# EAGLE design J6_output (EAGLE 7.5.0)
Redwave S310-J6 Output to 10 Pin MiniFit Valve Driver Board
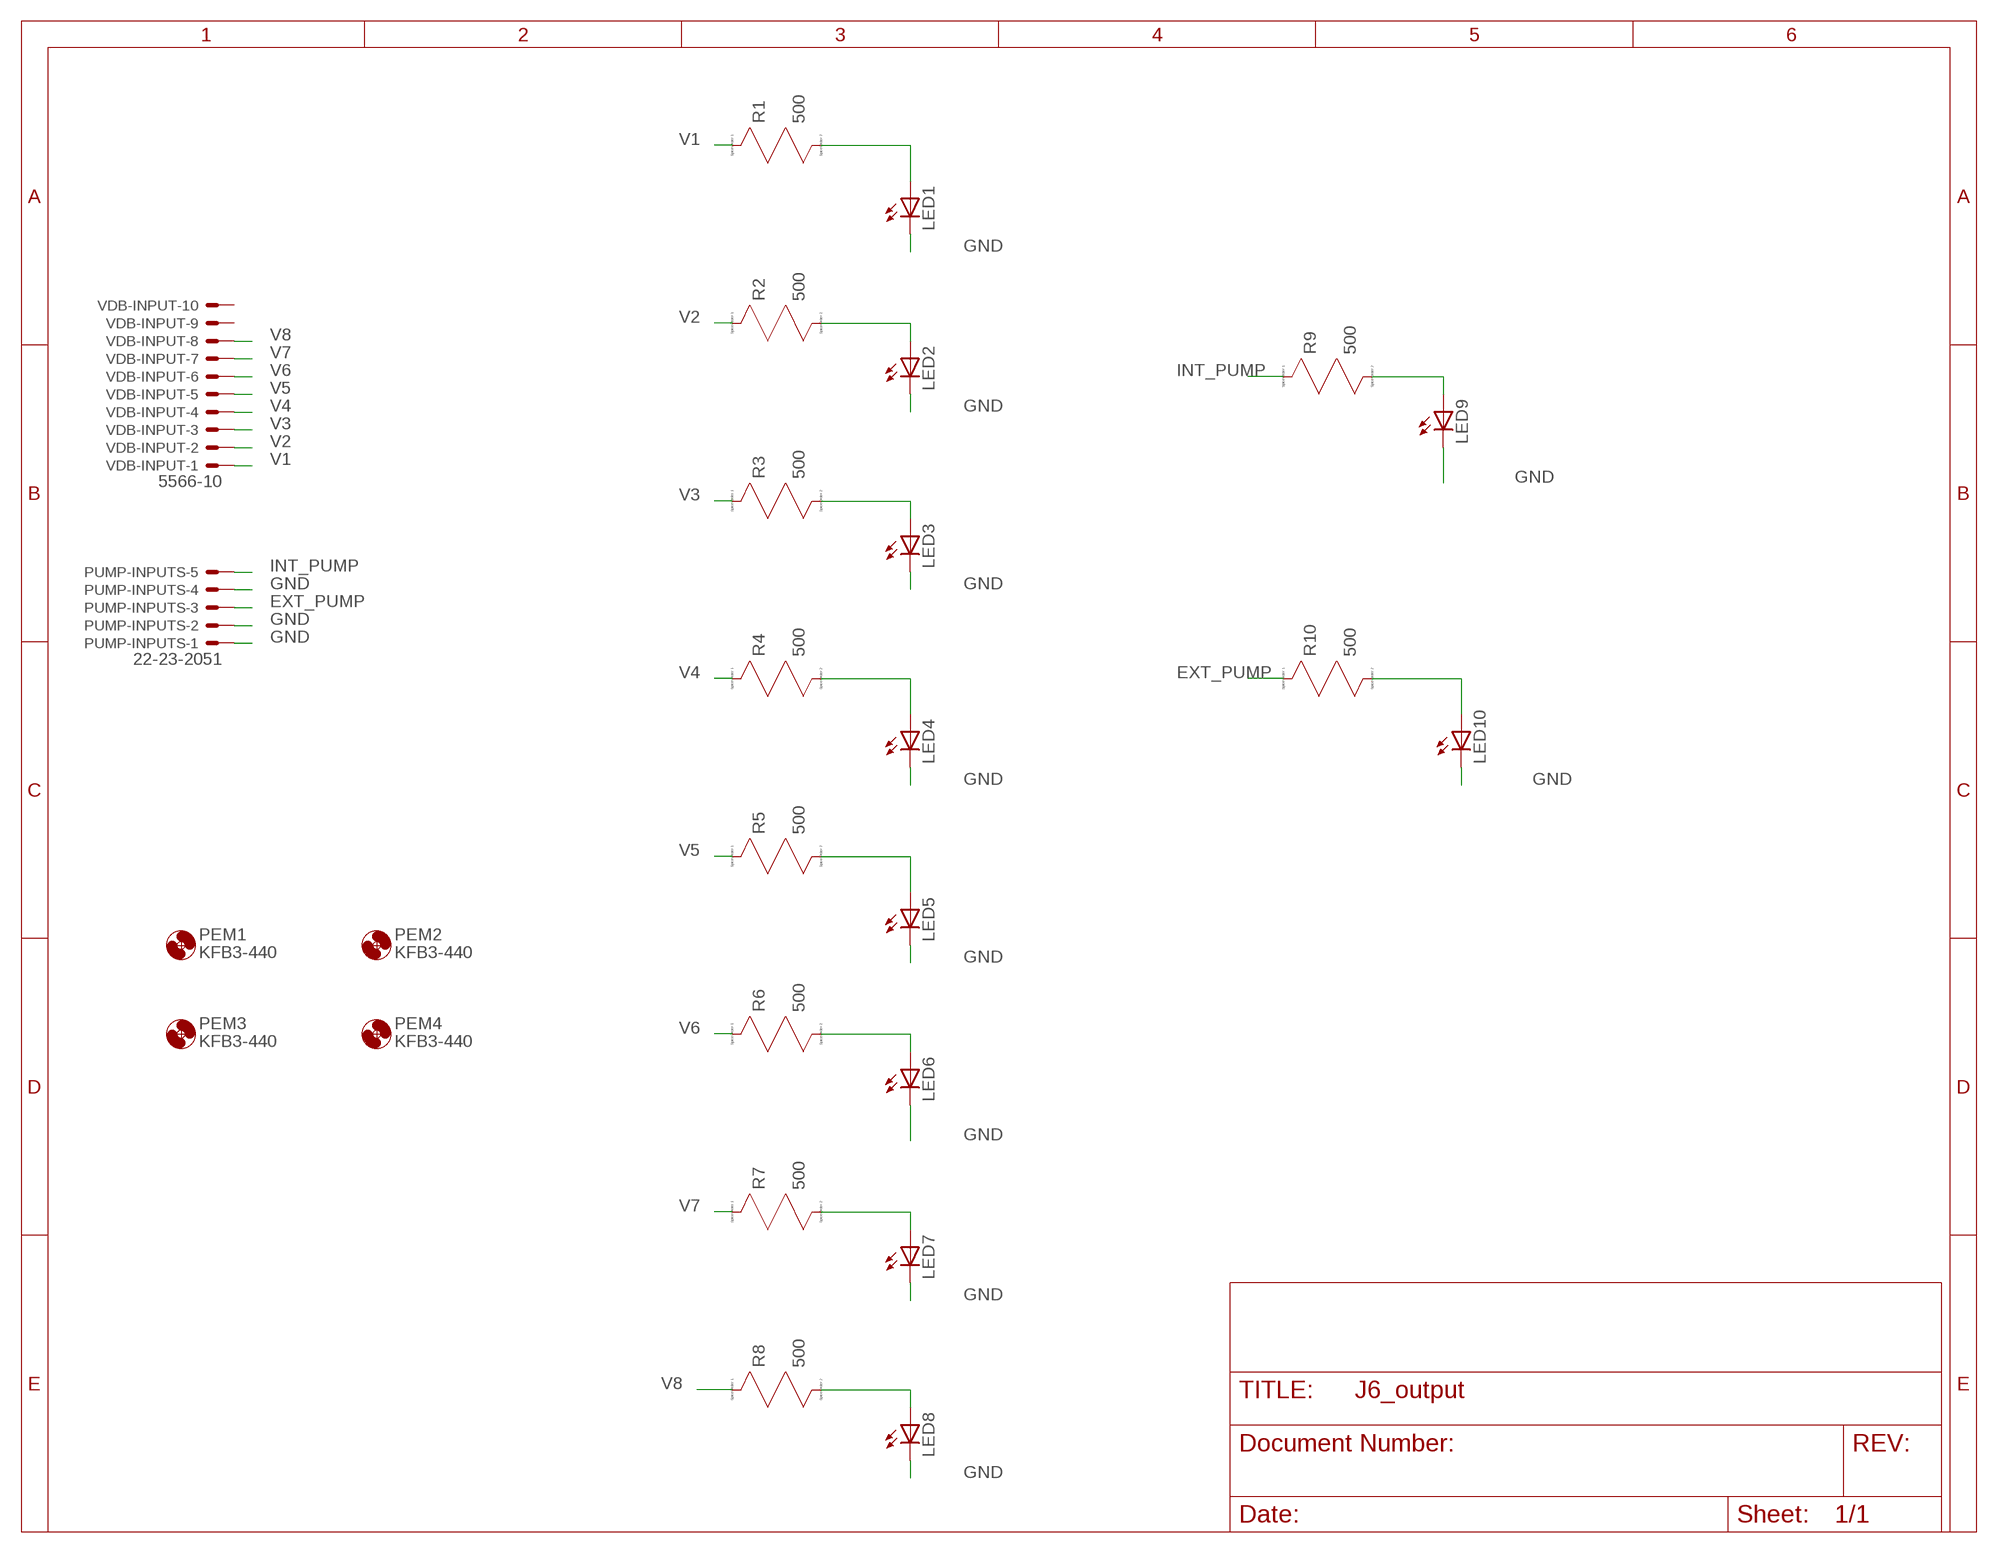
[diagram p0: schematic, sheet 1]

## Parts
LED1  LED10MM  [LED10MM]
LED2  LED10MM  [LED10MM]
LED3  LED10MM  [LED10MM]
LED4  LED10MM  [LED10MM]
LED5  LED10MM  [LED10MM]
LED6  LED10MM  [LED10MM]
LED7  LED10MM  [LED10MM]
LED8  LED10MM  [LED10MM]
LED9  LED10MM  [LED10MM]
LED10  LED10MM  [LED10MM]
PEM1  KFB3-440  [KFB3-440]
PEM2  KFB3-440  [KFB3-440]
PEM3  KFB3-440  [KFB3-440]
PEM4  KFB3-440  [KFB3-440]
PUMP-INPUTS  22-23-2051  [22-23-2051]
R1  500  RES  [R0805]
R2  500  RES  [R0805]
R3  500  RES  [R0805]
R4  500  RES  [R0805]
R5  500  RES  [R0805]
R6  500  RES  [R0805]
R7  500  RES  [R0805]
R8  500  RES  [R0805]
R9  500  RES  [R0805]
R10  500  RES  [R0805]
VDB-INPUT  5566-10  [5566-10]

## Nets
EXT_PUMP: PUMP-INPUTS.3 R10.1(A)
GND: LED1.K(C) LED2.K(C) LED3.K(C) LED4.K(C) LED5.K(C) LED6.K(C) LED7.K(C) LED8.K(C) LED9.K(C) LED10.K(C) PUMP-INPUTS.1 PUMP-INPUTS.2 PUMP-INPUTS.4
INT_PUMP: PUMP-INPUTS.5 R9.1(A)
N$1: LED1.A R1.2(B)
N$2: LED2.A R2.2(B)
N$3: LED3.A R3.2(B)
N$4: LED4.A R4.2(B)
N$5: LED5.A R5.2(B)
N$6: LED6.A R6.2(B)
N$7: LED7.A R7.2(B)
N$8: LED8.A R8.2(B)
N$9: LED9.A R9.2(B)
N$10: LED10.A R10.2(B)
V1: R1.1(A) VDB-INPUT.1
V2: R2.1(A) VDB-INPUT.2
V3: R3.1(A) VDB-INPUT.3
V4: R4.1(A) VDB-INPUT.4
V5: R5.1(A) VDB-INPUT.5
V6: R6.1(A) VDB-INPUT.6
V7: R7.1(A) VDB-INPUT.7
V8: R8.1(A) VDB-INPUT.8
Unconnected: VDB-INPUT.9 VDB-INPUT.10

## Library data of the parts
LED1-LED10 = led:LED: LED OSRAM: - CHIPLED LG R971, LG N971, LY N971, LG Q971, LY Q971, LO R971, LY R971 LH N974, LH R974 LS Q976, LO Q976, LY Q976 LO Q996 - Hyper CHIPLED LW Q18S LB Q993, LB Q99A, LB R99A - SideLED LS A670, LO A670, LY A670, LG A670, LP A670 LB A673, LV A673, LT A673, LW A673 LH A674 LY A675 LS A676, LA A676, LO A676, LY A676, LW A676 LS A679, LY A679, LG A679 - Hyper Micro SIDELED® LS Y876, LA Y876, LO Y876, LY Y876 LT Y87S - SmartLED LW L88C, LW L88S LB L89C, LB L89S, LG L890 LS L89K, LO L89K, LY L89K LS L896, LA L896, LO L896, LY L896 - TOPLED LS T670, LO T670, LY T670, LG T670, LP T670 LSG T670, LSP T670, LSY T670, LOP T670, LYG T670 LG T671, LOG T671, LSG T671 LB T673, LV T673, LT T673, LW T673 LH T674 LS T676, LA T676, LO T676, LY T676, LB T676, LH T676, LSB T676, LW T676 LB T67C, LV T67C, LT T67C, LS T67K, LO T67K, LY T67K, LW E67C LS E67B, LA E67B, LO E67B, LY E67B, LB E67C, LV E67C, LT E67C LW T67C LS T679, LY T679, LG T679 LS T770, LO T770, LY T770, LG T770, LP T770 LB T773, LV T773, LT T773, LW T773 LH T774 LS E675, LA E675, LY E675, LS T675 LS T776, LA T776, LO T776, LY T776, LB T776 LHGB T686 LT T68C, LB T68C - Hyper Mini TOPLED® LB M676 - Mini TOPLED Santana® LG M470 LS M47K, LO M47K, LY M47K Source: http://www.osram.convergy.de LUXEON: - LUMILED® LXK2-PW12-R00, LXK2-PW12-S00, LXK2-PW14-U00, LXK2-PW14-V00 LXK2-PM12-R00, LXK2-PM12-S00, LXK2-PM14-U00 LXK2-PE12-Q00, LXK2-PE12-R00, LXK2-PE12-S00, LXK2-PE14-T00, LXK2-PE14-U00 LXK2-PB12-K00, LXK2-PB12-L00, LXK2-PB12-M00, LXK2-PB14-N00, LXK2-PB14-P00, LXK2-PB14-Q00 LXK2-PR12-L00, LXK2-PR12-M00, LXK2-PR14-Q00, LXK2-PR14-R00 LXK2-PD12-Q00, LXK2-PD12-R00, LXK2-PD12-S00 LXK2-PH12-R00, LXK2-PH12-S00 LXK2-PL12-P00, LXK2-PL12-Q00, LXK2-PL12-R00 Source: www.luxeon.com KINGBRIGHT: KA-3528ASYC Source: www.kingbright.com; OC_NEWARK: unknown
PEM1-PEM4 = penn-engineering:KFB3-: TYPE KFB3 FLARE-MOUNTED STANDOFFS; OC_NEWARK: unknown
PUMP-INPUTS = con-molex:22-23-2051: .100" (2.54mm) Center Header - 5 Pin; OC_NEWARK: unknown
R1-R10 = sym:RES: A resistor; MF: BC COMPONENTS; MPN: SFR2500001401FR500; OC_NEWARK: 94C4790
VDB-INPUT = con-molex:5566-10: Mini FIT connector 10 pol Source: http://www.molex.com; MF: MOLEX; MPN: 39-29-6108; OC_NEWARK: 07H6587

## Board
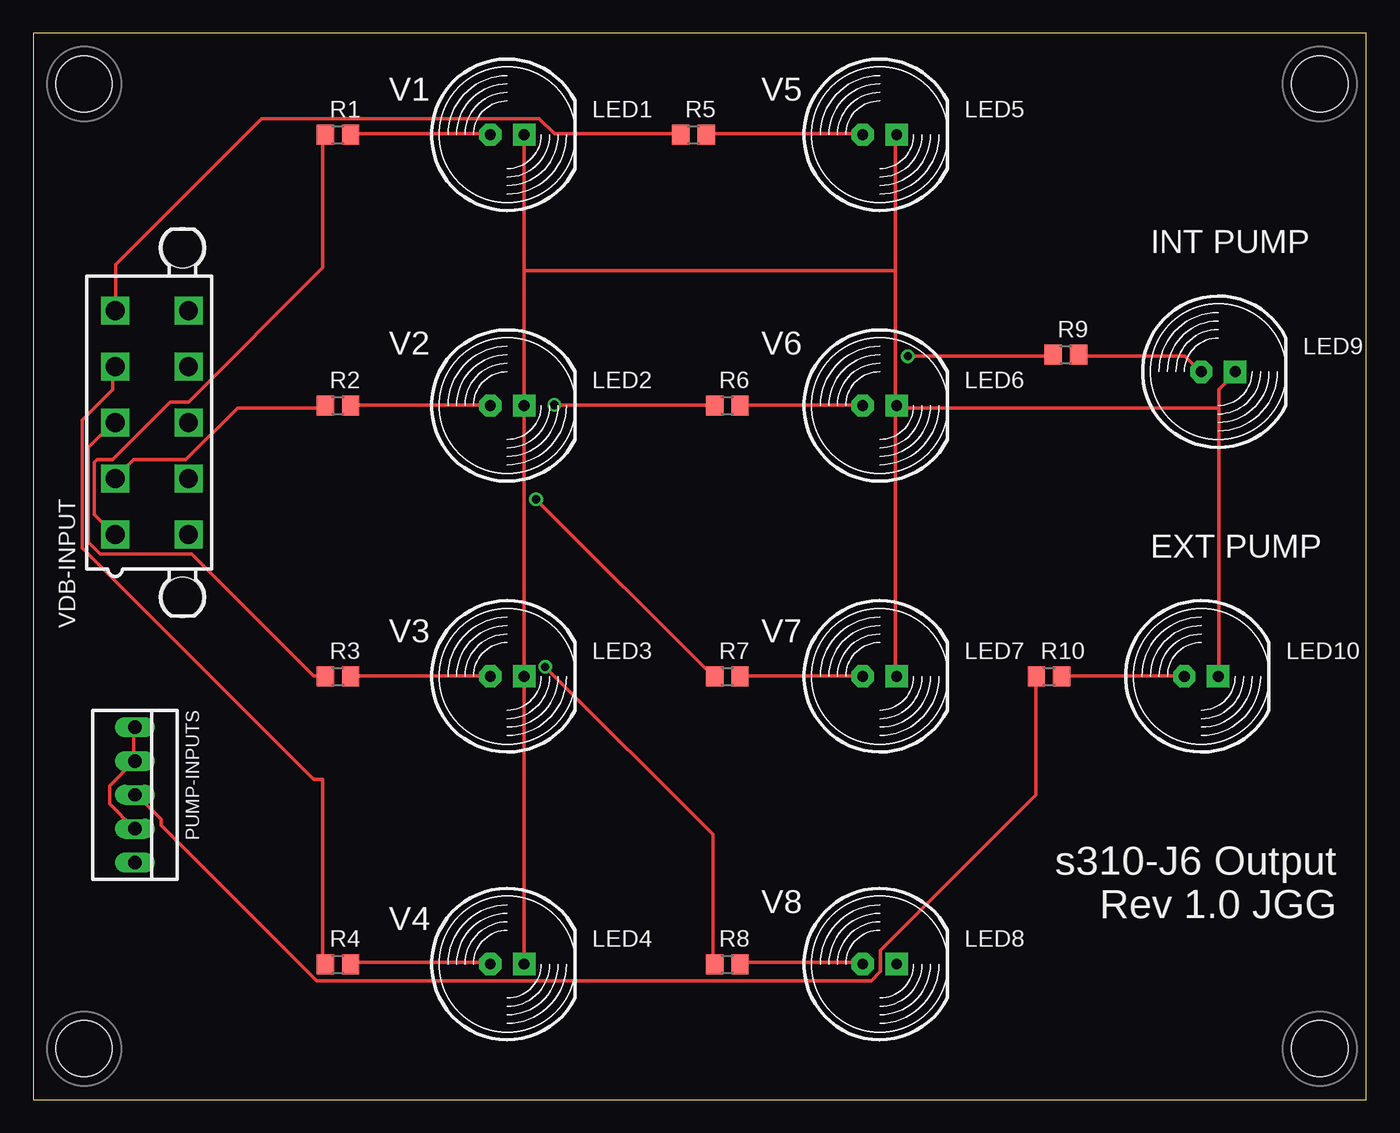
[diagram p1: board, top side]
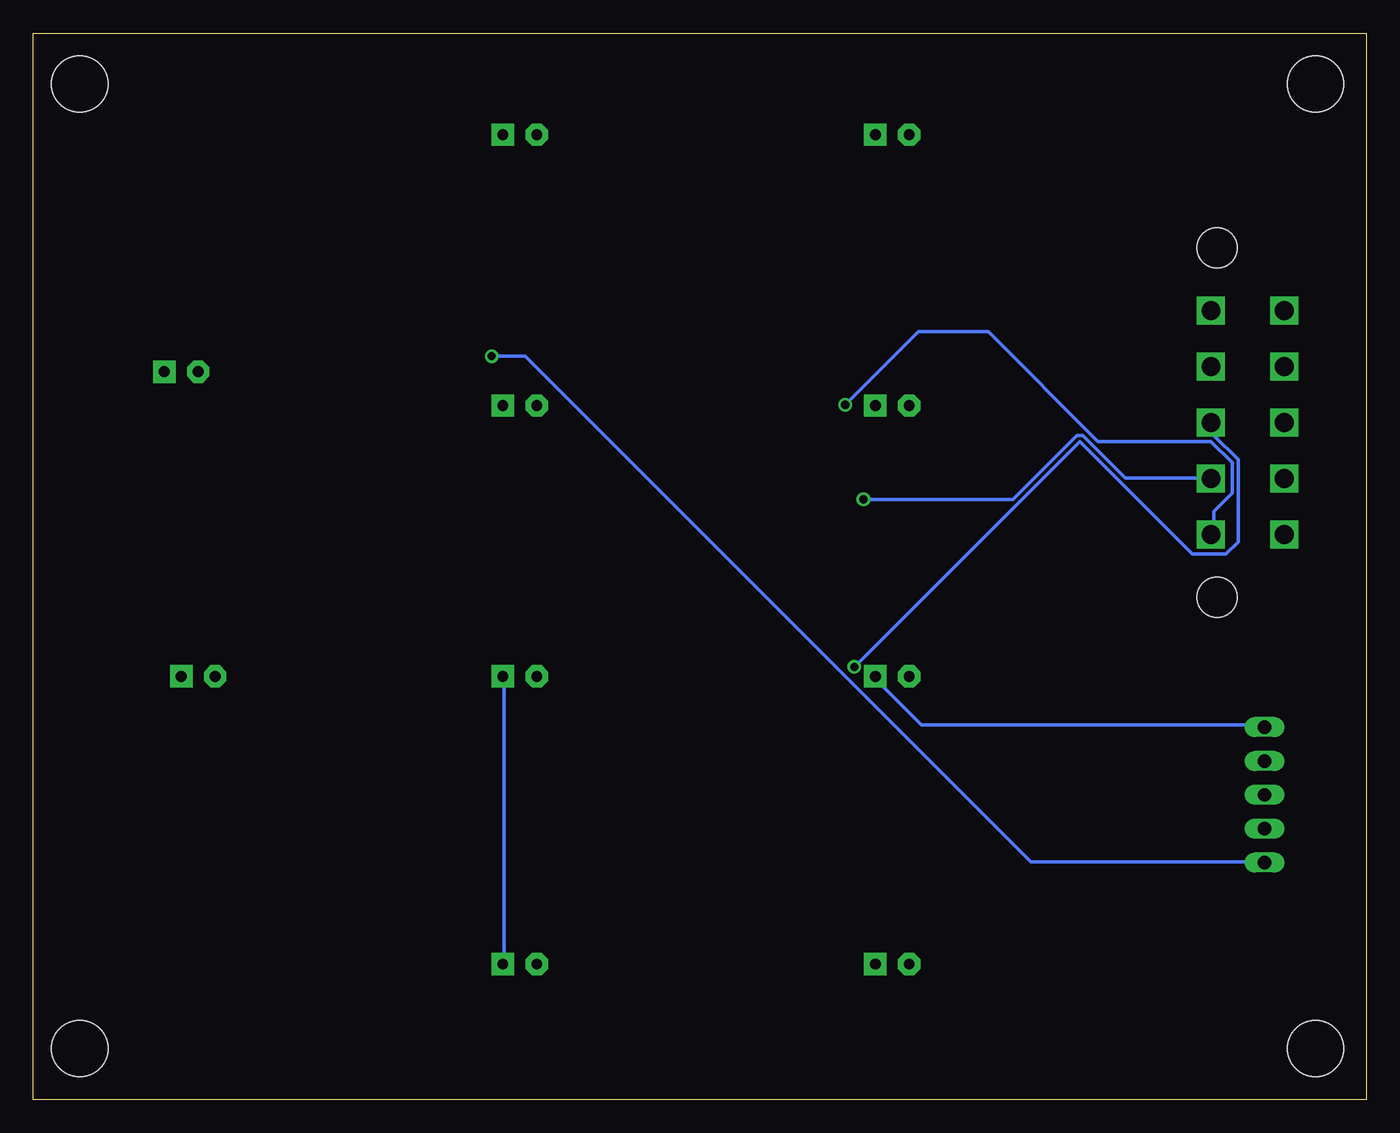
[diagram p2: board, bottom side, seen from below]

Size 100 x 80 mm. Coordinates in mm from the lower left corner, seen from the top.
Outline: 0,0 100,0 100,80 0,80 0,0
Copper layers (1*16): Top 0.035mm / dielectric 1.5mm / Bottom 0.035mm
Design rules "default": minimum track width 10mil, minimum drill 24mil, track to track 8mil, track to pad 8mil, pad to pad 8mil, via to via 8mil, smd to smd 8mil, copper to edge 40mil, drill to drill 8mil, minimum pad ring 10mil, minimum via ring 8mil, stop-mask expansion 4mil, vias tented up to drill 0mil, thermal gap 10mil

### Footprints (pad centres in the part's own frame; a part is rotated, then mirrored left to right if it is on the bottom)
LED10MM = drill 0.813 pad 1.676 octagon: A -1.27,0 | drill 0.813 pad 1.676 square: K 1.27,0
KFB3-440 = hole 4.216: 0,0
22-23-2051 = drill 1 long: 1 -5.08,0; 2 -2.54,0; 3 0,0; 4 2.54,0; 5 5.08,0
R0805 = smd 1.3 x 1.5: 1 -0.95,0; 2 0.95,0
5566-10 = drill 1.4 square: 1 8.4,-2.75; 2 4.2,-2.75; 3 0,-2.75; 4 -4.2,-2.75; 5 -8.4,-2.75; 6 8.4,2.75; 7 4.2,2.75; 8 0,2.75; 9 -4.2,2.75; 10 -8.4,2.75 | hole 3: 13.1,2.29; -13.1,2.29

### Placement (x,y rotation side)
LED1  35.56,72.39 0 top
LED2  35.56,52.07 0 top
LED3  35.56,31.75 0 top
LED4  35.56,10.16 0 top
LED5  63.5,72.39 0 top
LED6  63.5,52.07 0 top
LED7  63.5,31.75 0 top
LED8  63.5,10.16 0 top
LED9  88.9,54.61 0 top
LED10  87.63,31.75 0 top
PEM1  96.52,76.2 0 top
PEM2  96.52,3.81 0 top
PEM3  3.81,3.81 0 top
PEM4  3.81,76.2 0 top
PUMP-INPUTS  7.62,22.86 270 top
R1  22.86,72.39 0 top
R2  22.86,52.07 0 top
R3  22.86,31.75 0 top
R4  22.86,10.16 0 top
R5  49.53,72.39 0 top
R6  52.07,52.07 0 top
R7  52.07,31.75 0 top
R8  52.07,10.16 0 top
R9  77.47,55.88 0 top
R10  76.2,31.75 0 top
VDB-INPUT  8.89,50.8 270 top

### Tracks (layer width: path | path; a pad name or v marks a point on that pad's centre or on a via)
EXT_PUMP
  Top 0.254: R10.1 75.21,31.55 75.21,22.86 63.55,11.2 63.55,9.6 62.87,8.91 21.26,8.91 9.6,20.57 9.6,21.03 7.77,22.86 PUMP-INPUTS.3
GND
  Top 0.254: 88.92,51.89 88.92,53.26 90.07,54.41 LED9.K | 88.92,51.89 88.92,31.77 LED10.K | 64.69,62.18 64.69,72.24 LED5.K | 64.69,62.18 64.69,52.12 LED6.K | LED6.K 64.69,51.89 64.69,31.77 LED7.K | 88.92,51.89 64.92,51.89 LED6.K | 36.8,62.18 36.8,72.24 LED1.K | 36.8,62.18 36.8,52.12 LED2.K 36.8,51.89 36.8,31.77 LED3.K 36.8,31.55 36.8,10.29 LED4.K | PUMP-INPUTS.4 7.54,20.34 5.71,22.17 5.71,23.55 7.54,25.38 PUMP-INPUTS.2 7.54,25.6 7.54,27.89 PUMP-INPUTS.1 | 36.8,62.18 64.69,62.18
  Bottom 0.254: LED8.K 64.69,10.29 64.69,31.55 LED7.K | PUMP-INPUTS.1 6.5,28.12 33.38,28.12 36.8,31.55 LED3.K
INT_PUMP  (via drill 0.61)
  Top 0.254: v65.61,55.78 76.35,55.78 R9.1
  Bottom 0.254: v65.61,55.78 63.09,55.78 25.15,17.83 7.77,17.83 PUMP-INPUTS.5
N$1
  Top 0.254: R1.2 24,72.47 34.29,72.47 LED1.A
N$2
  Top 0.254: R2.2 24,52.12 34.29,52.12 LED2.A
N$3
  Top 0.254: R3.2 24,31.77 34.29,31.77 LED3.A
N$4
  Top 0.254: R4.2 24,10.29 34.29,10.29 LED4.A
N$5
  Top 0.254: LED5.A 62.18,72.47 50.52,72.47 R5.2
N$6
  Top 0.254: R6.2 53.03,52.12 62.18,52.12 LED6.A
N$7
  Top 0.254: R7.2 53.03,31.77 62.18,31.77 LED7.A
N$8
  Top 0.254: R8.2 53.03,10.29 62.18,10.29 LED8.A
N$9
  Top 0.254: R9.2 78.64,55.78 86.41,55.78 87.55,54.63 LED9.A
N$10
  Top 0.254: R10.2 77.27,31.77 86.18,31.77 LED10.A
V1
  Top 0.254: R1.1 21.72,72.24 21.72,62.41 11.66,52.35 10.29,52.35 5.94,48.01 4.8,48.01 4.57,47.78 4.57,43.89 5.94,42.52 VDB-INPUT.1
V2
  Top 0.254: 21.72,52.12 R2.1 21.72,51.89 15.32,51.89 11.43,48.01 7.54,48.01 6.17,46.63 VDB-INPUT.2
V3
  Top 0.254: R3.1 21.72,31.77 21.03,31.77 11.89,40.92 5.03,40.92 4.12,41.83 4.12,48.92 5.94,50.75 VDB-INPUT.3
V4
  Top 0.254: R4.1 21.72,10.29 21.72,24 21.03,24 3.66,41.38 3.66,50.98 5.94,53.26 5.94,54.86 VDB-INPUT.4
V5
  Top 0.254: R5.1 48.46,72.47 39.09,72.47 37.95,73.61 17.14,73.61 6.17,62.64 6.17,59.21 VDB-INPUT.5
V6  (via drill 0.61)
  Top 0.254: v39.09,52.12 50.98,52.12 R6.1
  Bottom 0.254: v39.09,52.12 33.6,57.61 28.35,57.61 20.12,49.38 11.66,49.38 10.06,47.78 10.06,45.49 11.43,44.12 11.43,42.52 VDB-INPUT.6
V7  (via drill 0.61)
  Top 0.254: v37.72,45.03 50.98,31.77 R7.1
  Bottom 0.254: v37.72,45.03 26.52,45.03 21.72,49.84 21.26,49.84 18.06,46.63 11.66,46.63 VDB-INPUT.7
V8  (via drill 0.61)
  Top 0.254: v38.41,32.46 50.98,19.89 50.98,10.29 R8.1
  Bottom 0.254: v38.41,32.46 21.49,49.38 13.03,40.92 10.52,40.92 9.6,41.83 9.6,48.01 11.43,49.84 11.43,50.75 VDB-INPUT.8

### Text on the board
tNames: V1 | V5 | INT PUMP | V2 | V6 | EXT PUMP | V3 | V7 | s310-J6 Output / Rev 1.0 JGG | V8 | V4